# EAGLE design Tetris (EAGLE 9.6.2)
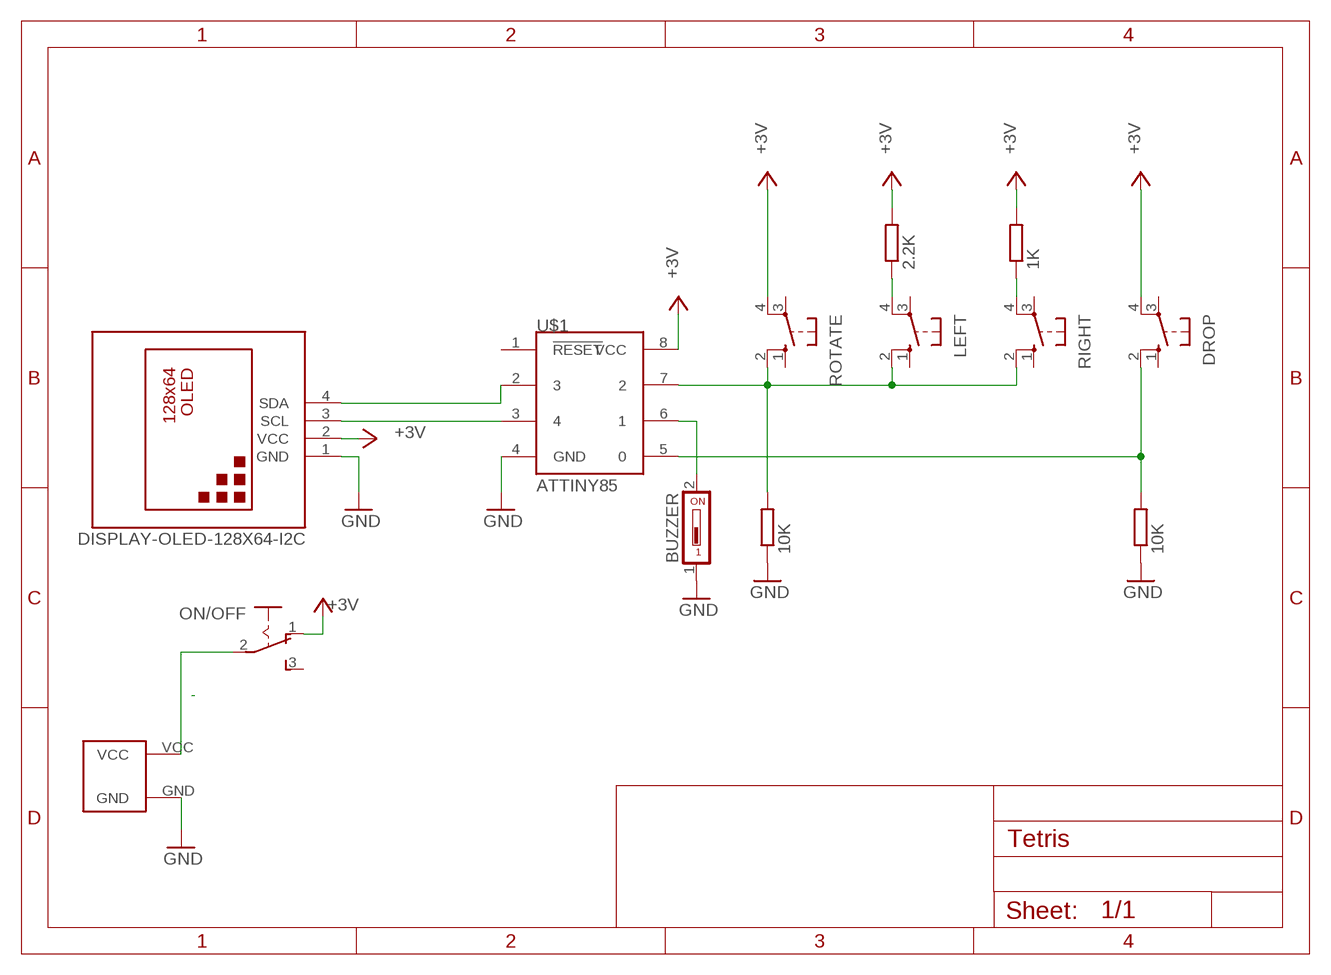
[diagram p0: schematic, sheet 1]

## Parts
BUZZER  DS01  [DS-01]
DROP  10-XX  [B3F-10XX]
LEFT  10-XX  [B3F-10XX]
ON/OFF  M251  [M251]
R1  2.2K  R-EU_0207/10  [0207/10]
R2  10K  R-EU_0207/10  [0207/10]
R3  1K  R-EU_0207/10  [0207/10]
R4  10K  R-EU_0207/10  [0207/10]
RIGHT  10-XX  [B3F-10XX]
ROTATE  10-XX  [B3F-10XX]
U$1  ATTINY85  [8P3]
U$2  DISPLAY-OLED-128X64-I2C  [DISPLAY-OLED-128X64-I2C]
U$5  CR2032  [CR2032-20MM]

## Nets
+3V3: DROP.4(P1) ON/OFF.1(O) R1.2 R3.2 ROTATE.4(P1) U$1.8(VCC) U$2.2(VCC) ; supply symbol labelled +3V
GND: BUZZER.1 R2.1 R4.1 U$1.4(GND) U$2.1(GND) U$5.GND
N$1: U$1.3 U$2.3(SCL)
N$2: U$1.2 U$2.4(SDA)
N$3: LEFT.4(P1) R1.1
N$4: DROP.2(S1) R2.2 U$1.5
N$5: BUZZER.2 U$1.6
N$6: R3.1 RIGHT.4(P1)
N$8: LEFT.2(S1) R4.2 RIGHT.2(S1) ROTATE.2(S1) U$1.7
N$10: ON/OFF.2(P) U$5.VCC
Unconnected: DROP.1(S) DROP.3(P) LEFT.1(S) LEFT.3(P) ON/OFF.3(S) RIGHT.1(S) RIGHT.3(P) ROTATE.1(S) ROTATE.3(P) U$1.1(!RESET)

## Library data of the parts
BUZZER = buzzer:DS01: DIL/CODE SWITCH; OC_FARNELL: unknown; OC_NEWARK: unknown
DROP LEFT RIGHT ROTATE = switch-omron:10-XX: OMRON SWITCH; MPN: B3F-1000; OC_FARNELL: 176432; OC_NEWARK: 36M3542
ON/OFF = switches M Dunn:M251: SLIDING SWITCH Mors, distributor Buerklin, 11G702
R1-R4 = rcl:R-EU_: RESISTOR, European symbol; SPICEPREFIX: R
U$1 = attiny85:ATTINY85
U$2 = diy-modules:DISPLAY-OLED-128X64-I2C: 128x64 Dot Matrix OLED Module based on SSD1306 chip Variant with I2C interface More details available here: http://www.instructables.com/id/Monochrome-096-i2c-OLED-display-with-arduino-SSD13/ SSD1306 datasheet: https://cdn-shop.adafruit.com/datasheets/SSD1306.pdf Click here to find device on ebay.com <http://www.ebay.com/sch/oled+display+128x64+iic> Note: There are two variants: I2C and SPI. Search for the proper version.
U$5 = cr2032:CR2032

## Board
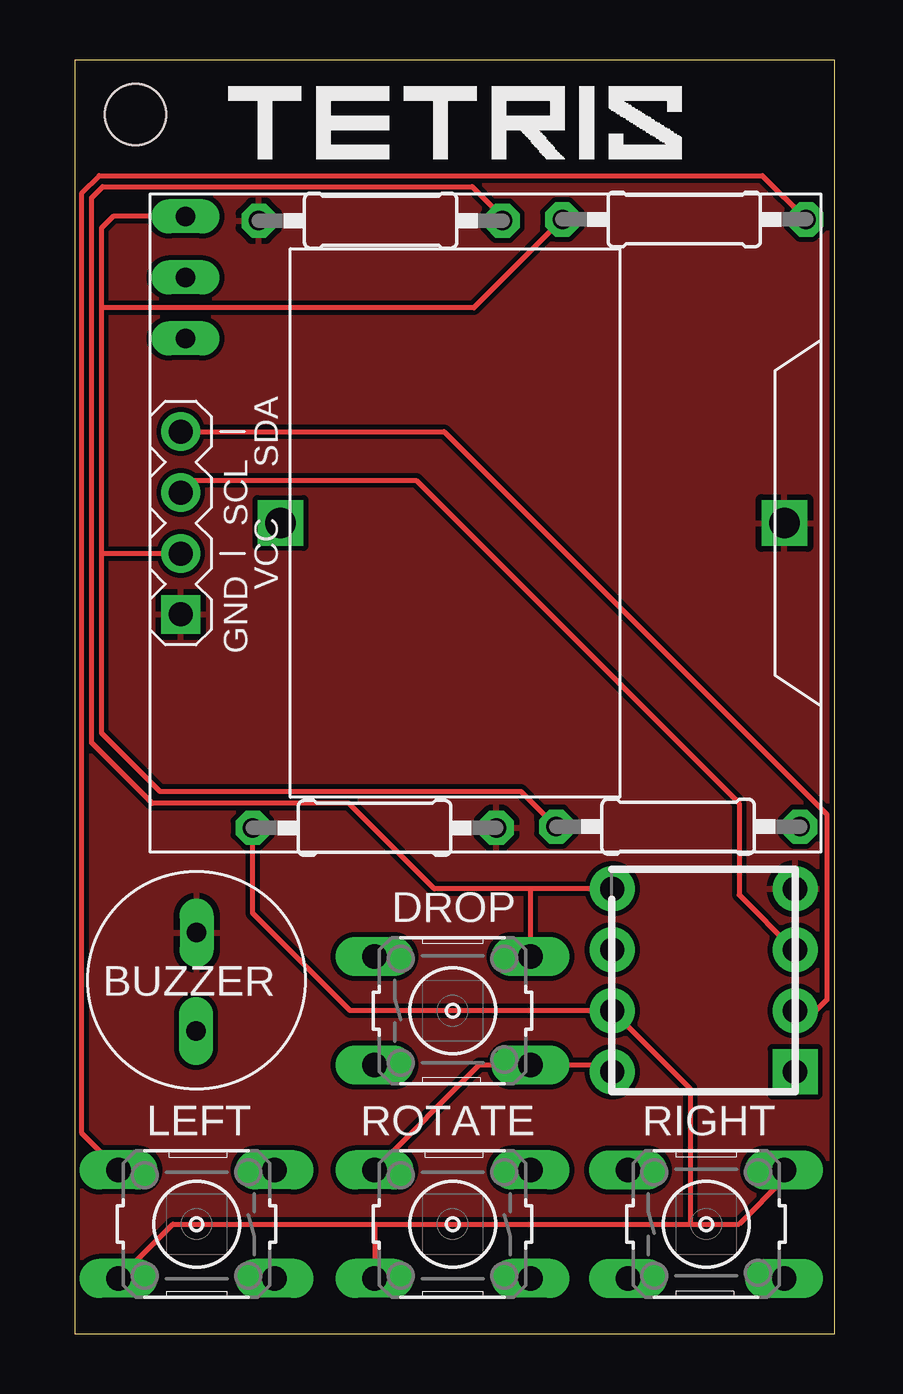
[diagram p1: board, top side]
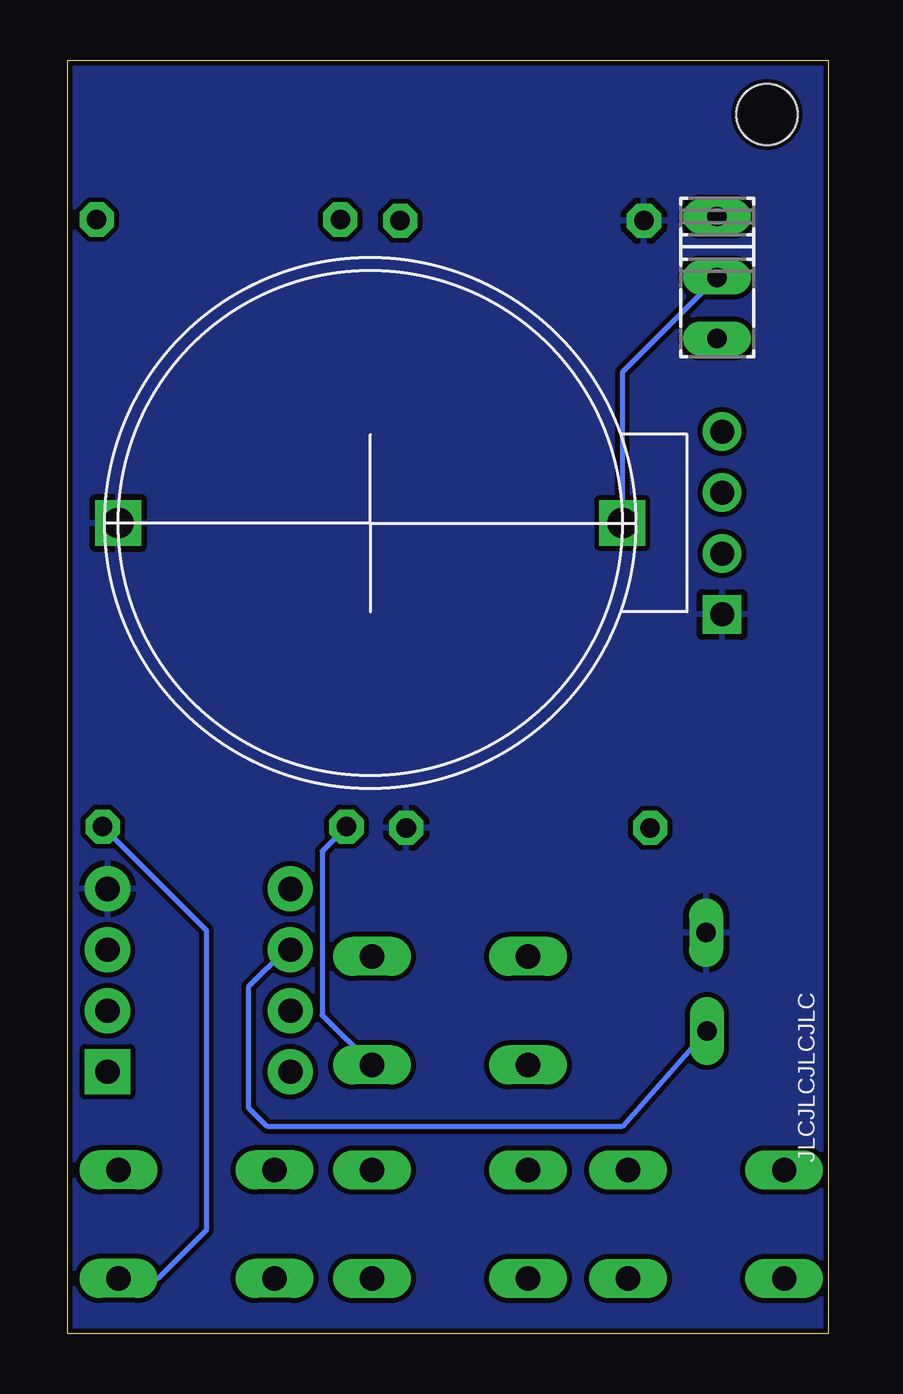
[diagram p2: board, bottom side, seen from below]

Size 31.67 x 53.08 mm. Coordinates in mm from the lower left corner, seen from the top.
Outline: 0,0 31.67,0 31.67,53.08 0,53.08 0,0
Copper layers (1*16): Top 0.035mm / dielectric 1.5mm / Bottom 0.035mm
Design rules "SparkFun": minimum track width 8mil, minimum drill 20mil, track to track 8mil, track to pad 8mil, pad to pad 8mil, via to via 8mil, smd to smd 8mil, copper to edge 8mil, drill to drill 8mil, minimum pad ring 12mil, minimum via ring 10mil, stop-mask expansion 4mil, vias tented up to drill 20mil, thermal gap 10mil
Holes 2.54 mm at 2.54,50.8

### Footprints (pad centres in the part's own frame; a part is rotated, then mirrored left to right if it is on the bottom)
DS-01 = drill 0.813 long: 1 0,-1.981; 2 0.025,2.108
B3F-10XX = drill 1.016 long: 1 -3.251,2.261; 2 3.251,2.261; 3 -3.251,-2.261; 4 3.251,-2.261
M251 = drill 0.813 long: 1 -2.54,0; 2 0,0; 3 2.54,0
0207/10 = drill 0.813 octagon: 1 -5.08,0; 2 5.08,0
8P3 = drill 1.016 pad 1.88 square: 1 -3.81,3.81 | drill 1.016 pad 1.88: 2 -3.81,1.27; 3 -3.81,-1.27; 4 -3.81,-3.81; 5 3.81,-3.81; 6 3.81,-1.27; 7 3.81,1.27; 8 3.81,3.81
DISPLAY-OLED-128X64-I2C = drill 1 square: 1 -3.81,12.7 | drill 1: 2 -1.27,12.7; 3 1.27,12.7; 4 3.81,12.7
CR2032-20MM = drill 1.27 square: GND 0,10.5; VCC 0,-10.5

### Placement (x,y rotation side)
BUZZER  5.08,14.73 180 top
DROP  15.75,13.46 0 top
LEFT  5.08,4.57 180 top
ON/OFF  4.62,44.02 270 bottom
R1  25.4,46.43 180 top
R2  12.75,46.38 0 top
R3  25.15,21.13 180 top
R4  12.5,21.08 180 top
RIGHT  26.31,4.57 0 top
ROTATE  15.75,4.57 180 top
U$1  26.21,14.73 180 top
U$2  17.12,33.78 90 top
U$5  19.08,33.78 90 bottom

### Tracks (layer width: path | path; a pad name or v marks a point on that pad's centre or on a via)
+3V3
  Top 0.203: ROTATE.4 16.87,11.2 DROP.4 22.12,11.2 U$1.8 | U$2.2 1.12,32.51 | 1.12,32.51 1.12,32.26 1.12,25.04 3.56,22.61 18.59,22.61 R3.2 | 1.12,42.75 16.64,42.75 R1.2 | ON/OFF.1 1.6,46.56 1.12,46.08 1.12,42.75 | 1.12,42.75 1.12,32.51
  Bottom 0.203: R3.2 21.08,20.12 21.08,13.28 DROP.4
GND
  pour Bottom: 0,53.09 31.75,53.09 31.75,0 0,0
  pour Top: 0,53.09 31.75,53.09 31.75,0 0,0
N$1
  Top 0.203: U$2.3 4.93,35.56 14.22,35.56 27.69,22.1 27.69,18.29 29.97,16 U$1.3
N$2
  Top 0.203: U$2.4 15.39,37.59 31.34,21.64 31.34,13.92 30.89,13.46 U$1.2
N$3
  Top 0.203: LEFT.4 0.3,8.36 0.3,47.55 1.02,48.26 28.65,48.26 R1.1
N$4
  Top 0.203: DROP.2 19,18.54 U$1.5 14.99,18.54 11.43,22.1 3.23,22.1 0.71,24.62 0.71,47.35 1.17,47.8 16.56,47.8 17.83,46.53 R2.2
N$5
  Bottom 0.203: BUZZER.2 8.59,8.64 23.37,8.64 24.13,9.4 24.13,14.48 22.61,16 U$1.6
N$6
  Bottom 0.203: R3.1 25.91,16.81 25.91,4.32 27.91,2.31 RIGHT.4
N$8
  Top 0.203: 12.45,4.57 25.65,4.57 | 25.65,4.57 27.69,4.57 29.57,6.45 RIGHT.2 | 25.65,4.57 25.65,10.21 U$1.7 11.48,13.46 7.42,17.53 R4.2 | LEFT.2 4.09,4.57 12.45,4.57 | 12.45,4.57 12.5,4.52 ROTATE.2
N$10
  Bottom 0.203: ON/OFF.2 8.57,40.07 U$5.VCC

### Text on the board
bPlace: JLCJLCJLCJLC